# EAGLE design xbr (EAGLE 6.5.0)
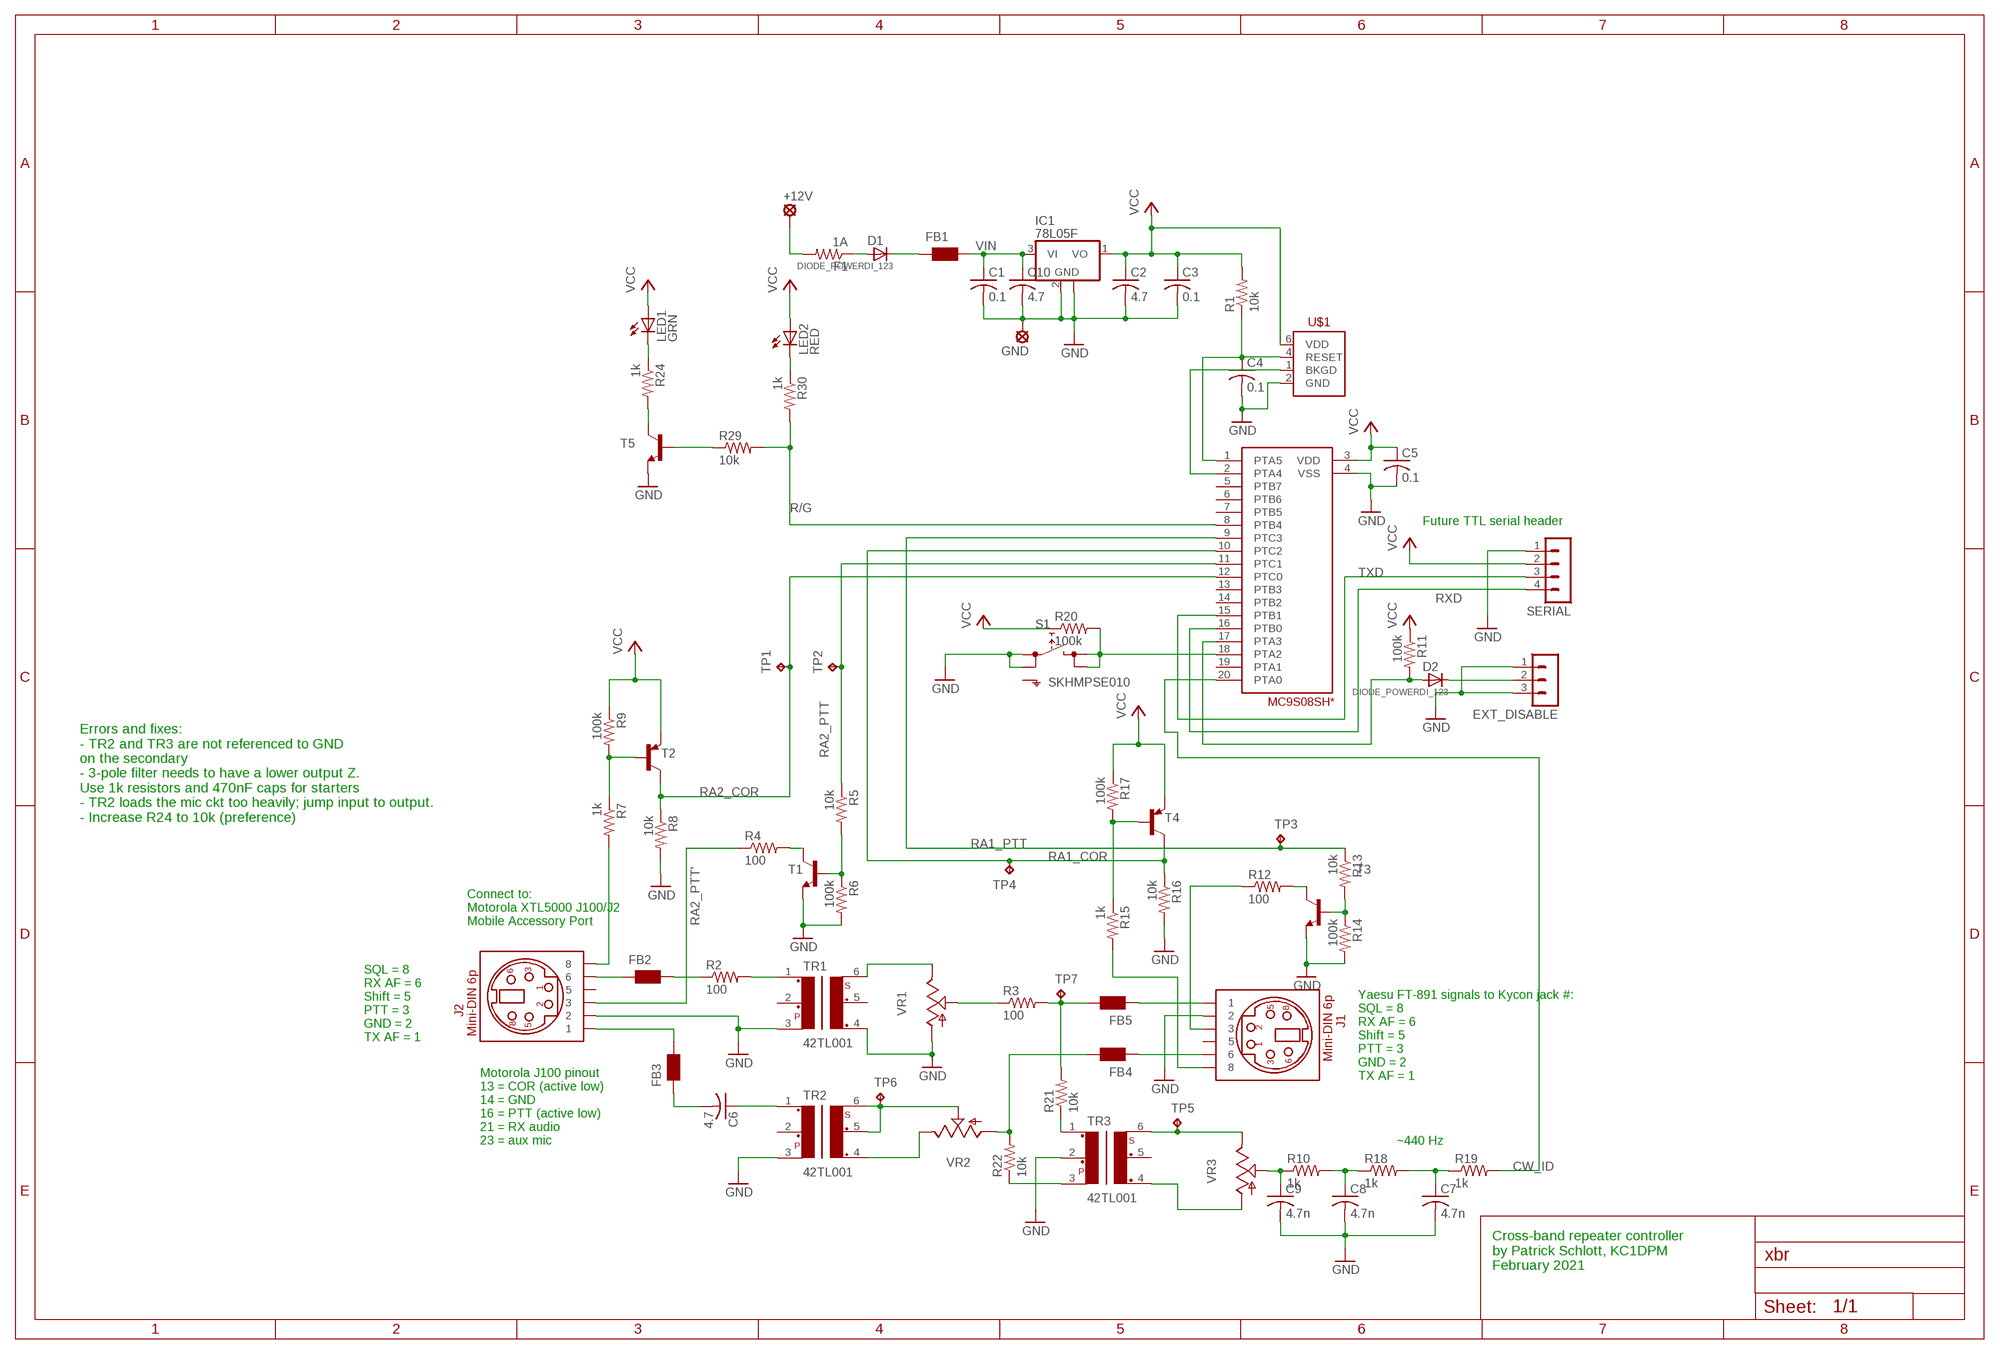
[diagram p0: schematic, sheet 1]

## Parts
+12V  LSP10  [LSP10]
C1  0.1  C-USC0603  [C0603]
C2  4.7  C-USC0805  [C0805]
C3  0.1  C-USC0603  [C0603]
C4  0.1  C-USC0603  [C0603]
C5  0.1  C-USC0603  [C0603]
C6  4.7  C-USC0805  [C0805]
C7  4.7n  C-USC0603  [C0603]
C8  4.7n  C-USC0603  [C0603]
C9  4.7n  C-USC0603  [C0603]
C10  4.7  C-USC0805  [C0805]
D1  DIODE_POWERDI_123  [POWERDI_123]
D2  DIODE_POWERDI_123  [POWERDI_123]
EXT_DISABLE  MA03-1  [MA03-1]
F1  1A  R-US_R0603  [R0603]
FB1  WE-CBF_0805  [0805]
FB2  WE-CBF_0805  [0805]
FB3  WE-CBF_0805  [0805]
FB4  WE-CBF_0805  [0805]
FB5  WE-CBF_0805  [0805]
GND  LSP10  [LSP10]
IC1  78L05F  [SOT89]
J1  MINIDIN-6P  [KMDTX-HT-6S-BSC]
J2  MINIDIN-6P  [KMDTX-HT-6S-BSC]
LED1  GRN  LEDCHIPLED_0603  [CHIPLED_0603]
LED2  RED  LEDCHIPLED_0805  [CHIPLED_0805]
R1  10k  R-US_R0603  [R0603]
R2  100  R-US_R1206  [R1206]
R3  100  R-US_R1206  [R1206]
R4  100  R-US_R1206  [R1206]
R5  10k  R-US_R0603  [R0603]
R6  100k  R-US_R0603  [R0603]
R7  1k  R-US_R0603  [R0603]
R8  10k  R-US_R0603  [R0603]
R9  100k  R-US_R0603  [R0603]
R10  1k  R-US_R0603  [R0603]
R11  100k  R-US_R0603  [R0603]
R12  100  R-US_R1206  [R1206]
R13  10k  R-US_R0603  [R0603]
R14  100k  R-US_R0603  [R0603]
R15  1k  R-US_R0603  [R0603]
R16  10k  R-US_R0603  [R0603]
R17  100k  R-US_R0603  [R0603]
R18  1k  R-US_R0603  [R0603]
R19  1k  R-US_R0603  [R0603]
R20  100k  R-US_R0603  [R0603]
R21  10k  R-US_R0603  [R0603]
R22  10k  R-US_R0603  [R0603]
R24  1k  R-US_R0603  [R0603]
R29  10k  R-US_R0603  [R0603]
R30  1k  R-US_R0603  [R0603]
S1  SKHMPSE010  [SKHMPXE010]
SERIAL  MA04-1  [MA04-1]
T1  MMBT2222ALT1-NPN-SOT23-BEC  [SOT23-BEC]
T2  MMBT3906LT1-PNP-SOT23-BEC  [SOT23-BEC]
T3  MMBT2222ALT1-NPN-SOT23-BEC  [SOT23-BEC]
T4  MMBT3906LT1-PNP-SOT23-BEC  [SOT23-BEC]
T5  MMBT2222ALT1-NPN-SOT23-BEC  [SOT23-BEC]
TP1  TPPAD1-13  [P1-13]
TP2  TPPAD1-13  [P1-13]
TP3  TPPAD1-13  [P1-13]
TP4  TPPAD1-13  [P1-13]
TP5  TPPAD1-13  [P1-13]
TP6  TPPAD1-13  [P1-13]
TP7  TPPAD1-13  [P1-13]
TR1  42TL001  [42TL]
TR2  42TL001  [42TL]
TR3  42TL001  [42TL]
U$1  BDM_HEADER  [2X03]
U$2  MC9S08SH  [PDIP-20]
VR1  TRIM_US-B64Y  [B64Y]
VR2  TRIM_US-B64Y  [B64Y]
VR3  TRIM_US-B64Y  [B64Y]

## Nets
CW_ID: R19.2 U$2.20(PTA0)
GND: C1.2 C2.2 C3.2 C4.2 C5.2 C7.2 C8.2 C9.2 C10.2 EXT_DISABLE.1 EXT_DISABLE.3 GND.MP IC1.2(GND) IC1.2@1(GND) J1.2-GND J2.2-GND R6.2 R8.2 R14.2 R16.2 S1.1(1.1) S1.2(1.2) SERIAL.1 T1.E T3.E T5.E TR1.3 TR1.4 TR2.3 TR3.2 U$1.2(GND) U$2.4(VSS) VR1.A
N$1: C4.1 R1.1 U$1.4(RESET) U$2.1(PTA5)
N$2: J2.8-SQL/COR R7.2
N$3: U$1.1(BKGD) U$2.2(PTA4)
N$4: FB2.2 R2.1
N$5: R2.2 TR1.1
N$6: R7.1 R9.2 T2.B
N$7: D1.K(C) FB1.1
N$8: TR1.6 VR1.E
N$9: R21.1 TR3.1
N$10: R3.1 VR1.S
N$11: FB5.2 R3.2 R21.2 TP7.TP
N$12: TR2.4 VR2.E
N$13: TP6.TP TR2.5 TR2.6 VR2.S
N$14: FB4.2 R22.2 VR2.A
N$15: C6.1 TR2.1
N$16: TP5.TP TR3.6 VR3.E
N$17: FB3.2 J2.1-DATA_IN
N$18: TR3.4 VR3.A
N$19: R4.2 T1.C
N$20: R5.2 R6.1 T1.B
N$21: C9.1 R10.1 VR3.S
N$22: D2.K(C) EXT_DISABLE.2
N$23: D2.A R11.2 U$2.17(PTA3)
N$24: R12.2 T3.C
N$25: R13.2 R14.1 T3.B
N$26: J1.8-SQL/COR R15.2
N$27: R15.1 R17.2 T4.B
N$28: R20.2 S1.3(2.1) S1.4(2.2) U$2.18(PTA2)
N$29: R22.1 TR3.3
N$31: C7.1 R18.2 R19.1
N$32: C8.1 R10.2 R18.1
N$33: LED1.C R24.1
N$34: R24.2 T5.C
N$35: LED2.C R30.1
N$41: FB2.1 J2.6-DATA_OUT
N$42: R29.1 T5.B
N$43: C6.2 FB3.1
N$44: D1.A F1.1
N$45: +12V.MP F1.2
N$47: FB4.1 J1.6-DATA_OUT
N$50: FB5.1 J1.1-DATA_IN
R/G: R29.2 R30.2 U$2.8(PTB4)
RA1_COR: R16.1 T4.C TP4.TP U$2.10(PTC2)
RA1_PTT: R13.1 TP3.TP U$2.9(PTC3)
RA1_PTT': J1.3-PTT R12.1
RA2_COR: R8.1 T2.C TP1.TP U$2.12(PTC0)
RA2_PTT: R5.1 TP2.TP U$2.11(PTC1)
RA2_PTT': J2.3-PTT R4.1
RXD: SERIAL.4 U$2.16(PTB0)
TXD: SERIAL.3 U$2.15(PTB1)
VCC: C2.1 C3.1 C5.1 IC1.1(VO) LED1.A LED2.A R1.2 R9.1 R11.1 R17.1 R20.1 SERIAL.2 T2.E T4.E U$1.6(VDD) U$2.3(VDD)
VIN: C1.1 C10.1 FB1.2 IC1.3(VI)
Unconnected: J1.5-SHIFT(FSK) J2.5-SHIFT(FSK) S1.5(SH) TR1.2 TR1.5 TR2.2 TR3.5 U$2.5(PTB7) U$2.6(PTB6) U$2.7(PTB5) U$2.13(PTB3) U$2.14(PTB2) U$2.19(PTA1)

## Notes on the sheet
- Future TTL serial header
- Errors and fixes:
  - TR2 and TR3 are not referenced to GND
  on the secondary
  - 3-pole filter needs to have a lower output Z. 
  Use 1k resistors and 470nF caps for starters
  - TR2 loads the mic ckt too heavily; jump input to output.
  - Increase R24 to 10k (preference)
- Connect to:
  Motorola XTL5000 J100/J2
  Mobile Accessory Port
- SQL = 8
  RX AF = 6
  Shift = 5
  PTT = 3
  GND = 2
  TX AF = 1
- Yaesu FT-891 signals to Kycon jack #:
  SQL = 8
  RX AF = 6
  Shift = 5
  PTT = 3
  GND = 2
  TX AF = 1
- Motorola J100 pinout
  13 = COR (active low)
  14 = GND
  16 = PTT (active low)
  21 = RX audio
  23 = aux mic
- ~440 Hz
- Cross-band repeater controller
  by Patrick Schlott, KC1DPM
  February 2021

## Library data of the parts
+12V GND = solpad:LSP10: SOLDER PAD drill 1.0 mm, distributor Buerklin, 12H555
C1-C10 = rcl:C-US: CAPACITOR, American symbol
D1 D2 = LEDdynamics_Diodes_SamCo:DIODE
EXT_DISABLE = con-lstb:MA03-1: PIN HEADER; OC_FARNELL: unknown; OC_NEWARK: unknown
F1 R1-R22 R24 R29 R30 = resistor:R-US_: RESISTOR, American symbol
FB1-FB5 = wuerth-elektronik:WE-CBF: SMD EMI Suppression Ferrite Beads - excellent anti-EMI properties - low DCR - impedances till 3000 ohms - rated current up to 6 A
IC1 = linear:78L*: POSITOIV-VOLTAGE REGULATORS Output up to 100 mA Source: http://focus.ti.com/lit/ds/symlink/ua78l05.pdf
J1 J2 = patrick:MINIDIN-6P: Kycon 6P Mini-DIN jack Fully shielded low profile right angle PCB mount
LED1 LED2 = led:LED: LED OSRAM: - CHIPLED LG R971, LG N971, LY N971, LG Q971, LY Q971, LO R971, LY R971 LH N974, LH R974 LS Q976, LO Q976, LY Q976 LO Q996 - Hyper CHIPLED LW Q18S LB Q993, LB Q99A, LB R99A - SideLED LS A670, LO A670, LY A670, LG A670, LP A670 LB A673, LV A673, LT A673, LW A673 LH A674 LY A675 LS A676, LA A676, LO A676, LY A676, LW A676 LS A679, LY A679, LG A679 - Hyper Micro SIDELED® LS Y876, LA Y876, LO Y876, LY Y876 LT Y87S - SmartLED LW L88C, LW L88S LB L89C, LB L89S, LG L890 LS L89K, LO L89K, LY L89K LS L896, LA L896, LO L896, LY L896 - TOPLED LS T670, LO T670, LY T670, LG T670, LP T670 LSG T670, LSP T670, LSY T670, LOP T670, LYG T670 LG T671, LOG T671, LSG T671 LB T673, LV T673, LT T673, LW T673 LH T674 LS T676, LA T676, LO T676, LY T676, LB T676, LH T676, LSB T676, LW T676 LB T67C, LV T67C, LT T67C, LS T67K, LO T67K, LY T67K, LW E67C LS E67B, LA E67B, LO E67B, LY E67B, LB E67C, LV E67C, LT E67C LW T67C LS T679, LY T679, LG T679 LS T770, LO T770, LY T770, LG T770, LP T770 LB T773, LV T773, LT T773, LW T773 LH T774 LS E675, LA E675, LY E675, LS T675 LS T776, LA T776, LO T776, LY T776, LB T776 LHGB T686 LT T68C, LB T68C - Hyper Mini TOPLED® LB M676 - Mini TOPLED Santana® LG M470 LS M47K, LO M47K, LY M47K Source: http://www.osram.convergy.de LUXEON: - LUMILED® LXK2-PW12-R00, LXK2-PW12-S00, LXK2-PW14-U00, LXK2-PW14-V00 LXK2-PM12-R00, LXK2-PM12-S00, LXK2-PM14-U00 LXK2-PE12-Q00, LXK2-PE12-R00, LXK2-PE12-S00, LXK2-PE14-T00, LXK2-PE14-U00 LXK2-PB12-K00, LXK2-PB12-L00, LXK2-PB12-M00, LXK2-PB14-N00, LXK2-PB14-P00, LXK2-PB14-Q00 LXK2-PR12-L00, LXK2-PR12-M00, LXK2-PR14-Q00, LXK2-PR14-R00 LXK2-PD12-Q00, LXK2-PD12-R00, LXK2-PD12-S00 LXK2-PH12-R00, LXK2-PH12-S00 LXK2-PL12-P00, LXK2-PL12-Q00, LXK2-PL12-R00 Source: www.luxeon.com KINGBRIGHT: KA-3528ASYC Source: www.kingbright.com
S1 = switch:SKHMP*E010: 6.2 X 6.5mm TACT Switch (SMD) Source: http://www3.alps.co.jp/WebObjects/catalog.woa/PDF/E/Switch/Tact/SKHM/SKHM.PDF
SERIAL = con-lstb:MA04-1: PIN HEADER; OC_FARNELL: unknown; OC_NEWARK: unknown
T1 T3 T5 = transistor:*-NPN-: NPN Transistror BF959 corrected 2008.03.06
T2 T4 = transistor:*-PNP-: PNP Transistror
TP1-TP7 = testpad:TP: Test pad
TR1-TR3 = trafo-xicon:42T?*: Xicon Micro-Mini EI-12 Audio Transformers 42TL/42TC/42TM Series Source: http://www.mouser.com//catalog/specsheets/164201.pdf http://www.mouser.com/catalog/specsheets/114225.pdf http://www.mouser.com/catalog/specsheets/164267.pdf; OC_FARNELL: unknown; OC_NEWARK: unknown
U$1 = LEDdynamics:BDM_HEADER
U$2 = patrick:MC9S08SH
VR1-VR3 = pot:TRIM_US-: POTENTIOMETER

## Board
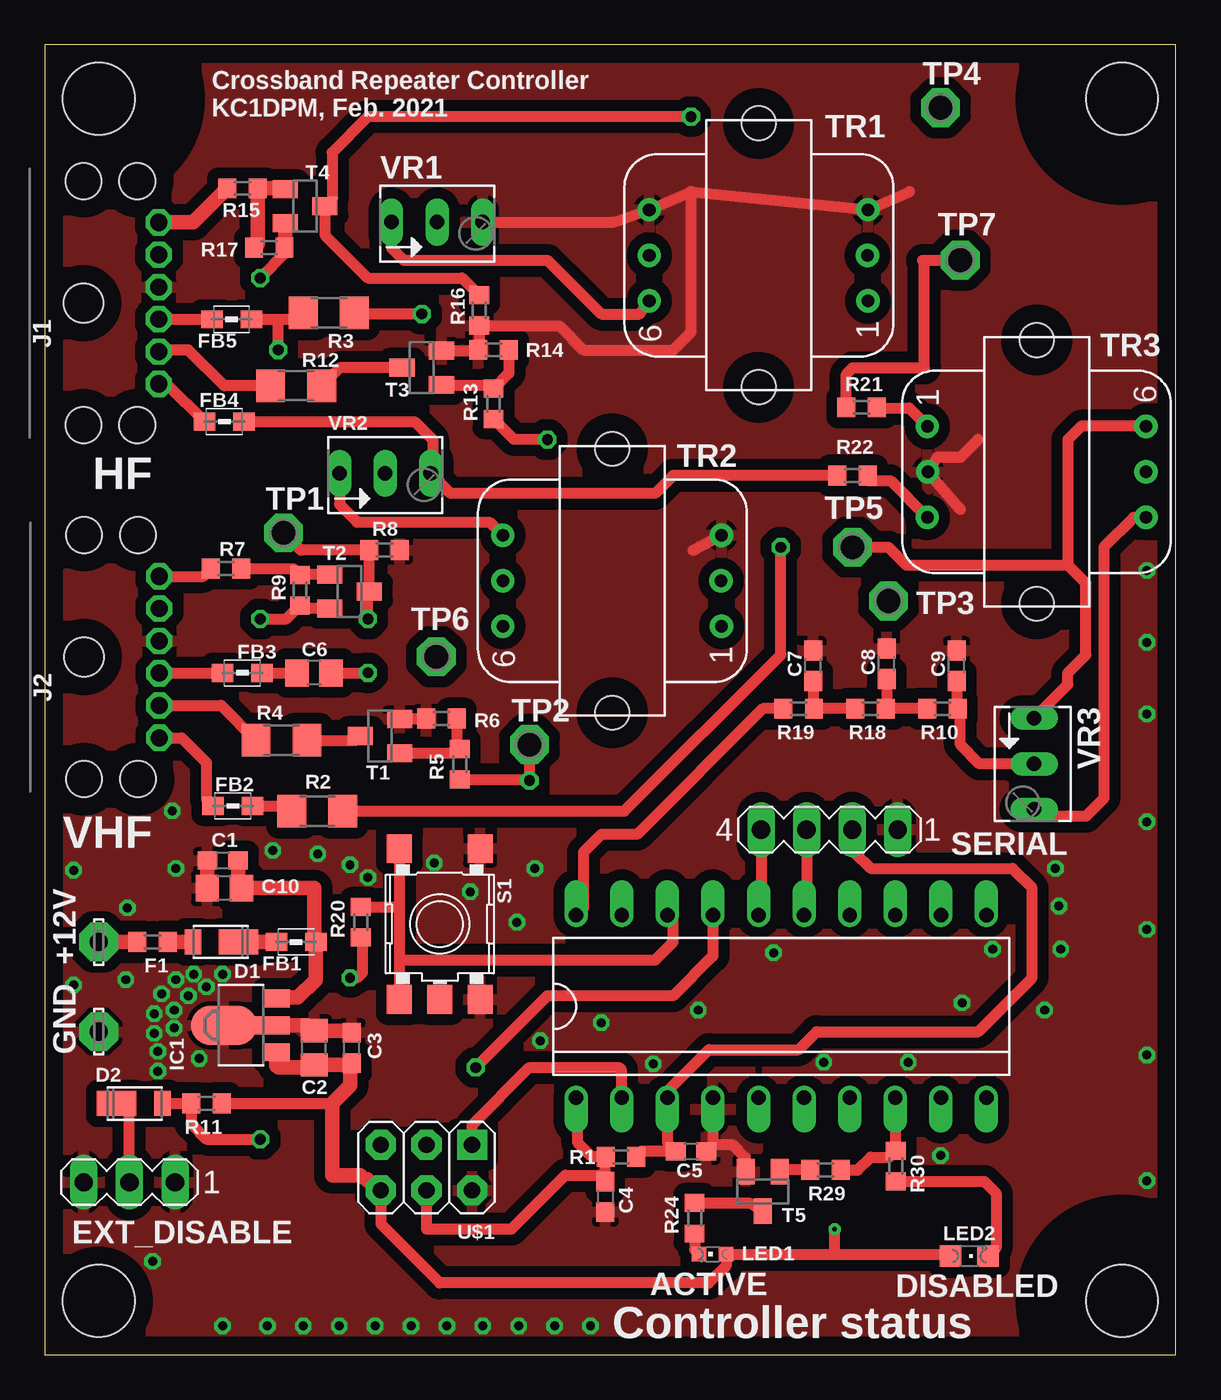
[diagram p1: board, top side]
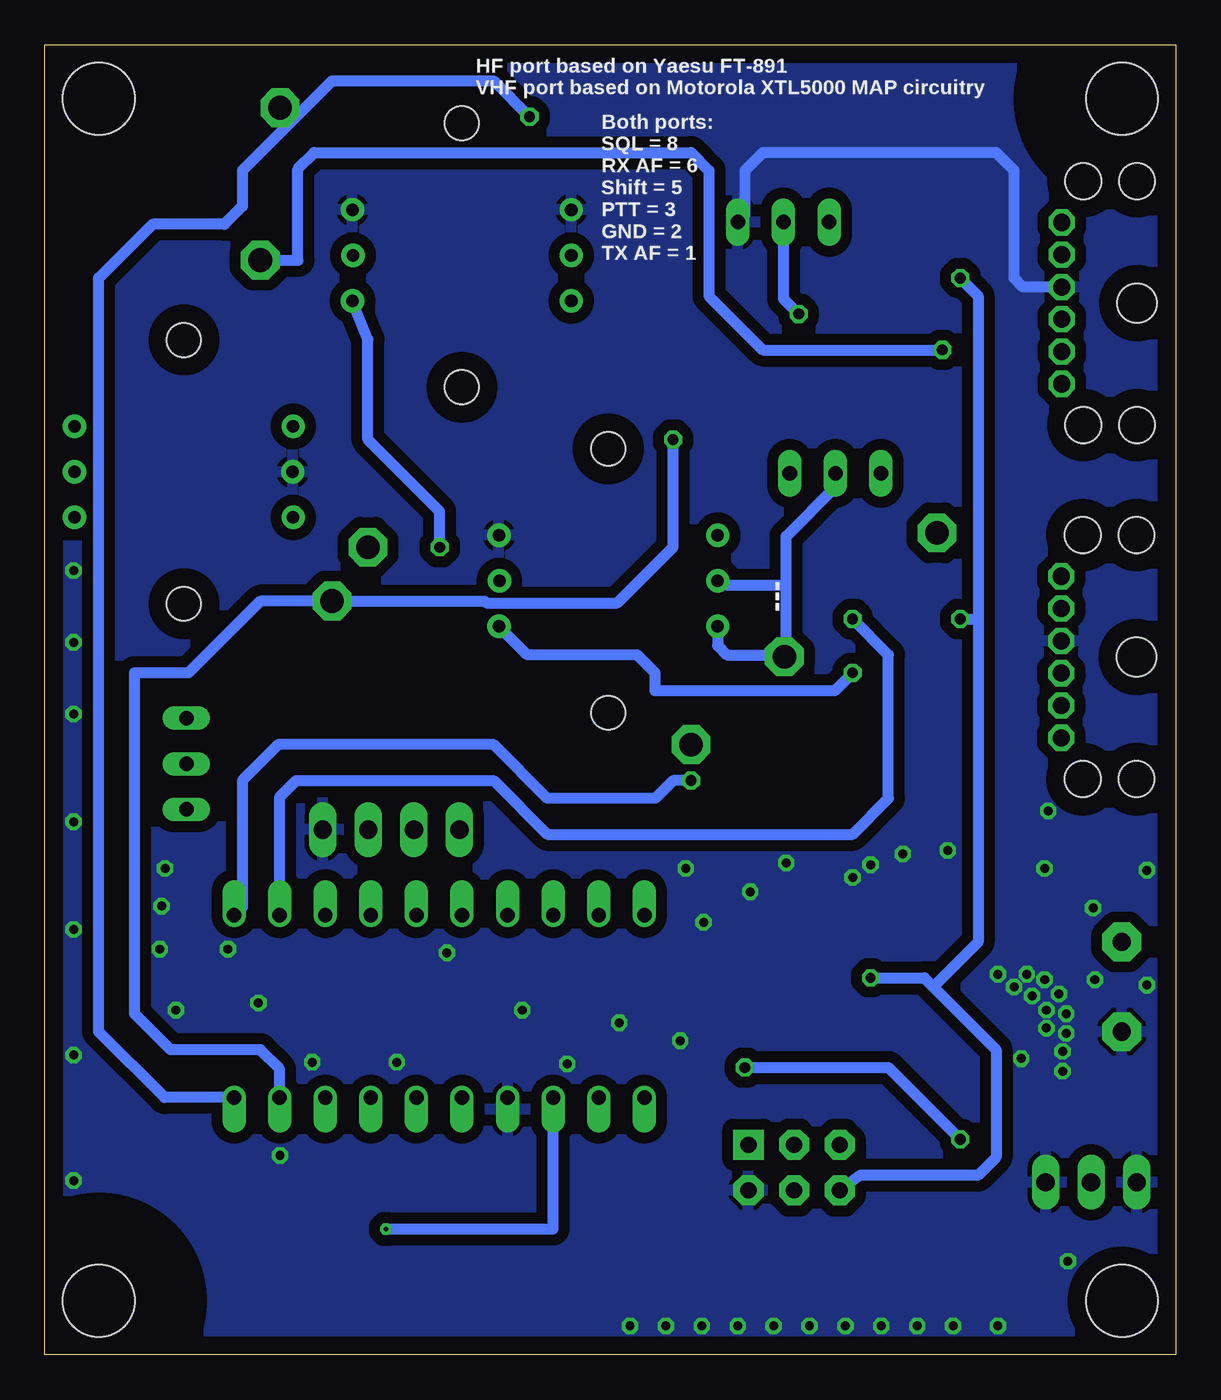
[diagram p2: board, bottom side, seen from below]

Size 63 x 73 mm. Coordinates in mm from the lower left corner, seen from the top.
Outline: 0,0 63,0 63,73 0,73 0,0
Copper layers (1*16): Top 0.035mm / dielectric 1.5mm / Bottom 0.035mm
Design rules "default *": minimum track width 10mil, minimum drill 24mil, track to track 10mil, track to pad 10mil, pad to pad 10mil, via to via 10mil, smd to smd 8mil, copper to edge 40mil, drill to drill 8mil, minimum pad ring 10mil, minimum via ring 8mil, stop-mask expansion 4mil, vias tented up to drill 0.7mm, thermal gap 10mil
Holes 4 mm at 3,70 60,70 60,3 3,3
tRestrict: area 55,65 to 65,75; area 55,-2 to 65,8; area -2,65 to 8,75
bRestrict: area 54.9,64.9 to 65.1,75.1; area 54.9,-2.1 to 65.1,8.1; area -2.1,64.9 to 8.1,75.1

### Footprints (pad centres in the part's own frame; a part is rotated, then mirrored left to right if it is on the bottom)
LSP10 = drill 1.016 pad 2.159 octagon: MP 0,0
C0603 = smd 1.1 x 1: 1 -0.85,0; 2 0.85,0
C0805 = smd 1.3 x 1.5: 1 -0.95,0; 2 0.95,0
POWERDI_123 = smd 0.9 x 1.4: A 2.55,0 | smd 2.2 x 1.4: K 0,0
MA03-1 = drill 1.016 long: 1 -2.54,0; 2 0,0; 3 2.54,0
R0603 = smd 1 x 1.1: 1 -0.85,0; 2 0.85,0
0805 = smd 1.2 x 1: 1 -1.1,0; 2 1.1,0
SOT89 = smd 1 x 1.5: 1 -1.499,-1.981; 3 1.499,-1.981 | smd 1 x 2: 2 0,-1.727 | smd 2.2 x 3.7: 2@1 0,0.94
KMDTX-HT-6S-BSC = drill 0.95 octagon: 1-DATA_IN 3.6,0; 2-GND 5.4,0; 3-PTT 1.8,0; 5-SHIFT(FSK) 7.2,0; 6-DATA_OUT 0,0; 8-SQL/COR 9,0 | hole 2: 11.3,1.2; -2.3,1.2; -2.3,4.2; 11.3,4.2 | hole 2.2: 4.5,4.2
CHIPLED_0603 = smd 0.8 x 0.8: A 0,-0.75; C 0,0.75
CHIPLED_0805 = smd 1.2 x 1.2: A 0,-1.05; C 0,1.05
R1206 = smd 1.6 x 1.803: 1 -1.422,0; 2 1.422,0
SKHMPXE010 = smd 1.6 x 1.4: 1 -4.2,2.25; 2 4.2,2.25; 3 -4.2,-2.25; 4 4.2,-2.25; 5 4.2,0
MA04-1 = drill 1.016 long: 1 -3.81,0; 2 -1.27,0; 3 1.27,0; 4 3.81,0
SOT23-BEC = smd 1 x 1.4: B -0.95,-1.1; C 0,1.1; E 0.95,-1.1
P1-13 = drill 1.321 pad 2.159 octagon: TP 0,0
42TL = drill 0.7 pad 1.3: 1 -2.54,-6.096; 2 0,-6.068; 3 2.54,-6.096; 4 2.54,6.096; 5 0,6.096; 6 -2.54,6.096 | hole 1.9: -7.353,0; 7.353,0
2X03 = drill 0.9 pad 1.676 square: 1 -2.54,-1.27 | drill 0.9 pad 1.676 octagon: 2 -2.54,1.27; 3 0,-1.27; 4 0,1.27; 5 2.54,-1.27; 6 2.54,1.27
PDIP-20 = drill 0.8 offset: 1 -5.08,8.89; 2 -5.08,6.35; 3 -5.08,3.81; 4 -5.08,1.27; 5 -5.08,-1.27; 6 -5.08,-3.81; 7 -5.08,-6.35; 8 -5.08,-8.89; 9 -5.08,-11.43; 10 -5.08,-13.97; 11 5.08,-13.97; 12 5.08,-11.43; 13 5.08,-8.89; 14 5.08,-6.35; 15 5.08,-3.81; 16 5.08,-1.27; 17 5.08,1.27; 18 5.08,3.81; 19 5.08,6.35; 20 5.08,8.89
B64Y = drill 0.813 long: A 2.54,0; E -2.54,0; S 0,0

### Placement (x,y rotation side)
+12V  3,23 90 top
C1  9.91,27.54 180 top
C2  15,17.1 90 top
C3  17.1,17.1 90 top
C4  31.22,8.8 270 top
C5  36,11.34 0 top
C6  15,38 180 top
C7  42.8,38.4 90 top
C8  46.9,38.5 90 top
C9  50.8,38.4 90 top
C10  10,26 180 top
D1  10.8,23 180 top
D2  4,14 0 top
EXT_DISABLE  4.71,9.61 180 top
F1  6,23 180 top
FB1  14,23 0 top
FB2  10.47,30.58 0 top
FB3  11,38 180 top
FB4  10,52 0 top
FB5  10.4,57.7 0 top
GND  3,18 90 top
IC1  10.92,18.36 90 top
J1  6.35,54.1 90 top
J2  6.38,34.38 90 top
LED1  37.2,5.6 90 top
LED2  51.5,5.5 270 top
R1  32.09,11.03 0 top
R2  15.18,30.29 0 top
R3  15.82,58.06 180 top
R4  13.18,34.24 0 top
R5  23.11,32.91 90 top
R6  22.09,35.46 180 top
R7  10.09,43.81 180 top
R8  18.91,44.84 0 top
R9  14.21,42.61 90 top
R10  50,36 180 top
R11  9,14 180 top
R12  14,54 0 top
R13  25,53 90 top
R14  25,56 180 top
R15  11,65 180 top
R16  24.2,58.2 270 top
R17  12.5,61.7 180 top
R18  46,36 180 top
R19  42,36 180 top
R20  17.6,24.1 90 top
R21  45.5,52.8 180 top
R22  45,49 180 top
R24  36.2,7.6 90 top
R29  43.5,10.3 0 top
R30  47.4,10.5 90 top
S1  22,24 270 top
SERIAL  43.71,29.26 180 top
T1  18.67,34.47 90 top
T2  16.98,42.53 270 top
T3  21,55 90 top
T4  14.5,64 270 top
T5  40,9.1 180 top
TP1  13.3,45.8 0 top
TP2  27,34 0 top
TP3  47,42 180 top
TP4  49.9,69.5 0 top
TP5  45,45 180 top
TP6  21.8,38.9 0 top
TP7  51,61 180 top
TR1  39.77,61.27 90 top
TR2  31.61,43.13 90 top
TR3  55.26,49.2 270 top
U$1  21.26,10.43 180 top
U$2  38.49,19.41 90 top
VR1  21.85,63.12 0 top
VR2  18.96,49.12 0 top
VR3  55.12,32.93 270 top

### Tracks (layer width: path | path; a pad name or v marks a point on that pad's centre or on a via)
CW_ID
  Top 0.61: U$2.20 30,24.89 30,28 31,29 33,29 40,36 R19.2
GND  (via drill 0.5)
  Top 0.61: VR1.A 31.71,63.12 TR1.4 36,64.83 | 36,64.83 TR1.3 48.17,64.83 | 52,51 51,50 49.71,50 TR3.2 51,47.11 | 36,64.83 36,57 35,56 30,56 28.65,57.35 R16.2 24.2,56.05 R14.2 24.1,55.95 T3.E | U$2.4 37.22,11.71 | 37.22,11.71 C5.2 | 36.11,44.84 TR2.3 | T1.E 19.81,35.46 R6.2 | 37.22,11.71 38.29,11.71 39,11 39,10.25 T5.E
  Top 0.813: C1.2 C10.2 | C3.2 17,18.05 C2.2 14.69,18.36 IC1.2 IC1.2@1
  Bottom 0.61: J1.2-GND 8.51,59.51 9,60 9,66 10,67 23,67 24,66 24,63.51 VR1.A
  other vias: 8,20 7.2,19.2 7.2,18.2 8.6,16.5 9,20.5 9.9,21.2 6.3,15.8 6.3,16.9 6.1,17.9 6.1,19 6.5,20.1 7.3,20.9 8.3,21.2 1.6,27 1.6,20.6 4.5,20.9 4.6,24.9 7.1,30.3 7.3,27.1 18,26.6 17,27.3 15.2,27.9 12.7,28.1 27.3,27.1 26.3,24.1 23.7,25.8 21.7,27.4 27.6,17.5 40.6,22.4 33.9,16.2 31,18.5 36.4,19.2 52.8,22.6 56.6,22.6 56.5,25 56.3,27.1 43.4,16.3 48.1,16.3 51.1,19.6 55.7,19.2 9.9,1.6 6,5.2 12.4,1.6 14.4,1.6 16.4,1.6 18.4,1.6 20.4,1.6 22.4,1.6 24.4,1.6 26.4,1.6 28.4,1.6 30.4,1.6 61.4,43.7 61.4,39.7 61.4,35.7 61.4,29.7 61.4,16.7 61.4,23.7 61.4,9.7 49.9,11.1
  pour Top (isolate 0.61): 0,73 63,73 63,0 0,0
  pour Bottom (isolate 0.61): 0,73 63,73 63,0 0,0
N$1
  Top 0.61: U$2.1 29.7,14.23 29.7,11.8 30.47,11.03 R1.1 31.22,11.01 C4.1 30.87,10 29,10 26,7 21.26,7 U$1.4
N$2
  Top 0.61: J2.8-SQL/COR 8.81,43.38 R7.2
N$3
  Top 0.61: U$2.2 32.14,15.86 32,16 27,16 23.8,12.8 U$1.1
N$4
  Top 0.61: FB2.2 13.47,30.58 R2.1
N$5  (via drill 0.6)
  Top 0.61: R2.2 32.29,30.29 41,39 v41,45
  Bottom 0.61: v41,45 41,47 45,51 45,56.59 TR1.1
N$6
  Top 0.61: R7.1 13.86,43.81 R9.2 14.23,43.48 T2.B
N$7
  Top 0.813: D1.K FB1.1
N$8
  Top 0.61: VR1.E 19.31,61.69 20,61 28,61 31,58 33.13,58 TR1.6
N$9
  Top 0.61: R21.1 46.39,52.76 48.15,52.76 TR3.1
N$10  (via drill 0.6)
  Top 0.61: v21,58 17.3,58 R3.1
  Bottom 0.61: VR1.S 21.85,58.85 v21,58
N$11  (via drill 0.6)
  Top 0.61: FB5.2 13,57.7 | 13,57.7 14.04,57.7 R3.2 | v13,56 13,57.7 | R21.2 44.65,54.65 45,55 49,55 49,60.91 48.91,61 TP7.TP
  Bottom 0.61: v13,56 23,56 26,59 26,66 27,67 48,67 48.91,66.09 48.91,61 TP7.TP
N$12
  Top 0.61: VR2.E 16.42,47.38 17.4,46.4 24.78,46.4 TR2.4
N$13
  Bottom 0.61: VR2.S 18.96,48.34 21.7,45.6 21.7,43 | TR2.5 25.03,42.9 21.8,42.9 21.7,43 | 21.7,43 21.7,39 TP6.TP 21.9,39 25,39 25.51,39.51 TR2.6
N$14
  Top 0.61: FB4.2 20.6,52 21.6,51 21.6,49.22 VR2.A 22.62,48 34,48 35,49 R22.2
N$15  (via drill 0.6)
  Top 0.61: C6.1 v18,38
  Bottom 0.61: v18,38 19,37 29,37 29,38 30,39 36.12,39 TR2.1
N$16
  Top 0.61: 57,44 57,51 57.74,51.74 TR3.6 | VR3.E 57,37.35 57,38 58,39 58,43 57,44 | TP5.TP 47,45 48,44 57,44
N$17
  Top 0.61: J2.1-DATA_IN 9.88,37.98 FB3.2
N$18
  Top 0.61: VR3.A 55.51,30 58,30 59,31 59,45 60.66,46.66 TR3.4
N$19
  Top 0.61: R4.2 17.34,34.24 T1.C
N$20
  Top 0.61: R6.1 22.94,33.93 R5.2 22.87,33.52 T1.B
N$21
  Top 0.61: VR3.S 52.07,32.93 51,34 51,35.85 R10.1 50.8,36.05 C9.1
N$22
  Top 0.61: EXT_DISABLE.2 4.71,13.99 4.7,14 D2.K
N$23  (via drill 0.6)
  Top 0.61: D2.A R11.2 8.15,12.85 9,12 v12,12 | U$2.17 37.22,22.22 35,20 28,20 v24,16
  Bottom 0.61: v24,16 16,16 v12,12
N$24
  Top 0.61: T3.C 16.42,55 R12.2
N$25
  Top 0.61: R14.1 25.85,54.7 R13.2 24.8,54.05 T3.B
N$26
  Top 0.813: J1.8-SQL/COR 8.26,63.1 R15.2
N$27
  Top 0.813: T4.B 13.35,65 R15.1 11.85,61.9 R17.2
N$28
  Top 0.61: 19.75,22 34,22 35,23 35,24.17 U$2.18 | S1.3 19.75,25 | 19.75,25 19.75,22 | 19.75,22 S1.4 | R20.2 19.7,24.95 19.75,25
N$29
  Top 0.61: R22.1 45.85,48.7 47.12,48.7 TR3.3
N$31
  Top 0.61: R18.2 R19.1 42.8,36.05 C7.1
N$32
  Top 0.61: R10.2 R18.1 46.9,36.05 C8.1
N$33
  Top 0.61: R24.1 36.2,5.85 LED1.C
N$34
  Top 0.61: R24.2 39.25,8.45 T5.C
N$35
  Top 0.61: R30.1 52.35,9.65 53,9 53,5.95 LED2.C
N$41
  Top 0.61: J2.6-DATA_OUT 7.62,34.38 9,33 9,30.95 FB2.1
N$42
  Top 0.61: R29.1 41.05,10.3 T5.B
N$43
  Top 0.61: FB3.1 C6.2
N$44
  Top 0.813: F1.1 D1.A
N$45
  Top 0.813: +12V.MP F1.2
N$47
  Top 0.61: J1.6-DATA_OUT 6.79,54.1 FB4.1
N$50
  Top 0.61: J1.1-DATA_IN FB5.1
R/G
  Top 0.61: U$2.8 47.38,11.37 R30.2 47.05,11 46,11 45.3,10.3 R29.2
RA1_COR  (via drill 0.6)
  Top 0.61: R16.1 23.25,60 18,60 15.6,62.4 T4.C 16,64.4 16,67 18,69 v36,69
  Bottom 0.61: U$2.10 56.33,14.33 60,18 60,60 57,63 53,63 52,64 52,66 49.5,68.5 | TP4.TP 49.9,68.9 49.5,68.5 | 49.5,68.5 47,71 38,71 v36,69
RA1_PTT  (via drill 0.6)
  Top 0.61: v28,51 26.15,51 R13.1
  Bottom 0.61: U$2.9 49.92,15.92 51,17 56,17 58,19 58,38 55,38 51,42 TP3.TP 38.5,42 38.4,41.9 31.1,41.9 28,45 v28,51
RA1_PTT'
  Top 0.61: R12.1 10,54 8,56 6.45,56 J1.3-PTT
RA2_COR  (via drill 0.6)
  Top 0.61: v18,41 18,42.45 T2.C 18.08,44.82 R8.1 14.26,44.84 TP1.TP
  Bottom 0.61: v18,41 16,39 16,31 18,29 35,29 38,32 49,32 49.92,31.08 U$2.12
RA2_PTT  (via drill 0.6)
  Top 0.61: R5.1 26.94,32.06 v27,32 TP2.TP
  Bottom 0.61: v27,32 28,32 29,31 35,31 38,34 50,34 52,32 52,24.95 U$2.11
RA2_PTT'
  Top 0.61: J2.3-PTT 9.82,36.18 R4.1
RXD
  Top 0.61: SERIAL.4 39.9,24.63 U$2.16
TXD
  Top 0.61: SERIAL.3 42.44,24.63 U$2.15
VCC  (via drill 0.25, 0.54, 0.6)
  Top 0.61: R1.2 33.25,11.34 C5.1 34.68,11.81 U$2.3 34.68,14.68 37,17 42,17 43,18 52,18 55,21 55,26 53.9,27.1 46,27.1 45.1,28 45,28 45,29.24 SERIAL.2 | LED1.A 50.35,5.6 LED2.A | LED1.A 37.95,4.95 37,4 22,4 18.72,7.28 U$1.6 18,9.88 | T2.E 14.39,41.58 R9.1 13.45,41 v12,41 | R11.1 16,14 | R17.1 13.35,61.35 v12,60 | v17,21 17.4,21 17.7,21.3 17.7,23.15 R20.1 | LED1.A 44,5.6 v44,7
  Top 0.813: T4.E 13.4,61.75 R17.1 | 17,16.15 C2.1 14.85,16 13,16 12.9,16.1 IC1.1 | 17,16.15 C3.1 | 17,16.15 17,15 16,14 16,10 17.56,10 U$1.6
  Bottom 0.61: v12,60 11,59 11,41 | 11,41 11,23 13.5,20.5 | v12,41 11,41 | v17,21 14,21 13.5,20.5 | 13.5,20.5 10,17 10,11 11,10 17.56,10 U$1.6 | v44,7 34.68,7 U$2.3
VIN
  Top 0.813: C1.1 10.76,26.19 C10.1 15,26 15,23.1 FB1.2 15.1,20.9 14.1,19.9 12.94,19.9 IC1.3

### Text on the board
tPlace: Crossband Repeater Controller / KC1DPM, Feb. 2021 | HF | VHF | ACTIVE | DISABLED | Controller status
bPlace: HF port based on Yaesu FT-891 / VHF port based on Motorola XTL5000 MAP circuitry | Both ports: / SQL = 8 / RX AF = 6 / Shift = 5 / PTT = 3 / GND = 2 / TX AF = 1 | ---